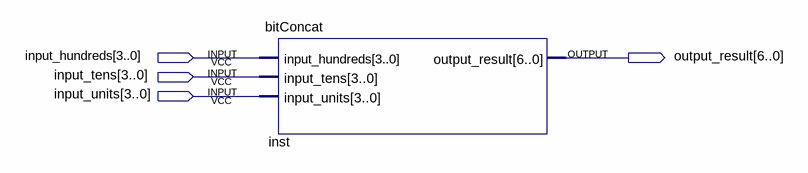
[diagram p0: schematic sheet]
// Quartus schematic testBitConcat.bdf as structural Verilog: 1 symbols, 4 pins
module testBitConcat (
  input  [3:0] input_hundreds,
  input  [3:0] input_tens,
  input  [3:0] input_units,
  output [6:0] output_result
);

  bitConcat inst (
    .input_hundreds(input_hundreds), .input_tens(input_tens), .input_units(input_units),
    .output_result(output_result));
endmodule
